# Altium schematic sheet Sheet_clock_circuite.SchDoc
size A3
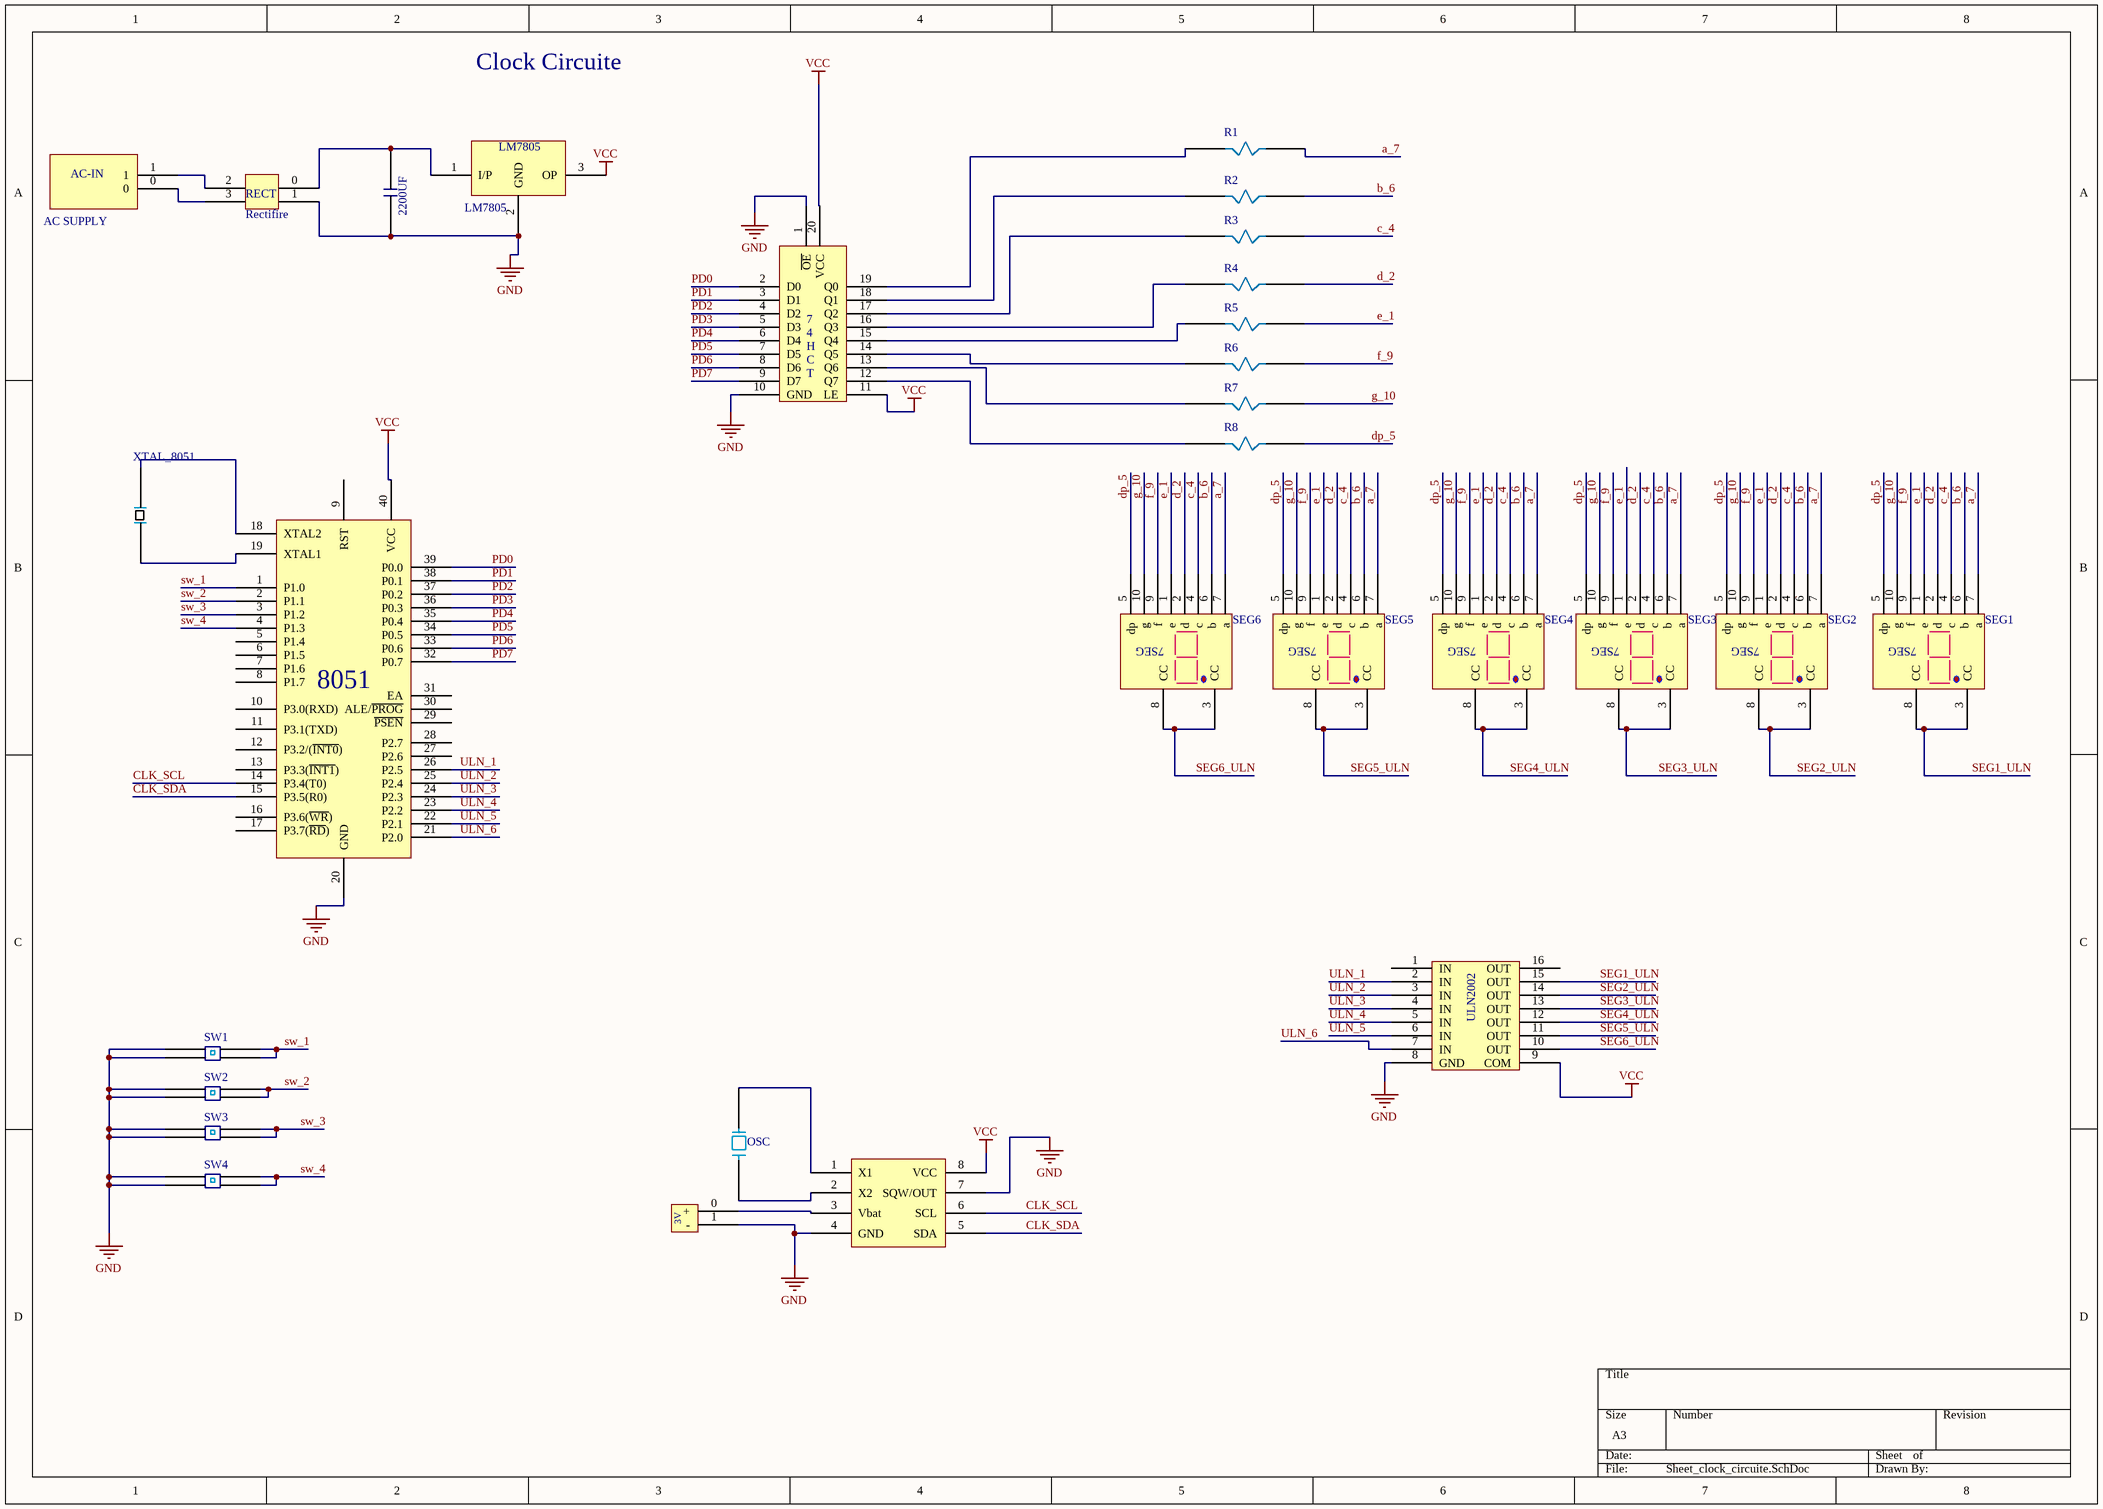
[diagram p0: Sheet_clock_circuite.SchDoc]

## Parts
3V  Battery_3V  [3V BAT]  (value not drawn)
74HCT  74_HCT  [74HCT]  (value not drawn)
7805  LM7805  [L7805]
8051  Microcontroller  [NUV_8051]  (value not drawn)
110592MHZ  XTAL_8051  [osc_12]
AC  AC SUPPLY  [CONNECTOR]
CAP  CF2200UF  [CAP2200UF]  (value not drawn)
CLK  DS1307_RTC  [DS1307]  (value not drawn)
OSC  OSCILLATOR  [OSC_32K]  (value not drawn)
R1  RES330  [RES]  (value not drawn)
R2  RES330  [RES]  (value not drawn)
R3  RES330  [RES]  (value not drawn)
R4  RES330  [RES]  (value not drawn)
R5  RES330  [RES]  (value not drawn)
R6  RES330  [RES]  (value not drawn)
R7  RES330  [RES]  (value not drawn)
R8  RES330  [RES]  (value not drawn)
REC  Rectifire  [RECT]
SEG1  7SEGMENT  [LED_Display]  (value not drawn)
SEG2  7SEGMENT  [LED_Display]  (value not drawn)
SEG3  7SEGMENT  [LED_Display]  (value not drawn)
SEG4  7SEGMENT  [LED_Display]  (value not drawn)
SEG5  7SEGMENT  [LED_Display]  (value not drawn)
SEG6  7SEGMENT  [LED_Display]  (value not drawn)
SW1  SWITCH  [SWITCH]  (value not drawn)
SW2  SWITCH  [SWITCH]  (value not drawn)
SW3  SWITCH  [SWITCH]  (value not drawn)
SW4  SWITCH  [SWITCH]  (value not drawn)
uln  ULN2002  [ULN2002]  (value not drawn)

## Nets
GND: 3V.1(-) 74HCT.1(~{OE}) 74HCT.10(GND) 7805.2(GND) 8051.20(GND) CAP.1 CLK.4(GND) CLK.7(SQW/OUT) REC.1 SW1.0 SW1.1 SW2.0 SW2.1 SW3.0 SW3.1 SW4.0 SW4.1 uln.8(GND)
VCC: 74HCT.11(LE) 74HCT.20(VCC) 7805.3(OP) 8051.40(VCC) CLK.8(VCC) uln.9(COM)
a_7: R1.1 SEG1.7(a) SEG2.7(a) SEG3.7(a) SEG4.7(a) SEG5.7(a) SEG6.7(a)
b_6: R2.1 SEG1.6(b) SEG2.6(b) SEG3.6(b) SEG4.6(b) SEG5.6(b) SEG6.6(b)
c_4: R3.1 SEG1.4(c) SEG2.4(c) SEG3.4(c) SEG4.4(c) SEG5.4(c) SEG6.4(c)
CLK_SCL: 8051.14(P3.4(T0)) CLK.6(SCL)
CLK_SDA: 8051.15(P3.5(R0)) CLK.5(SDA)
d_2: R4.1 SEG1.2(d) SEG2.2(d) SEG3.2(d) SEG4.2(d) SEG5.2(d) SEG6.2(d)
dp_5: R8.1 SEG1.5(dp) SEG2.5(dp) SEG3.5(dp) SEG4.5(dp) SEG5.5(dp) SEG6.5(dp)
e_1: R5.1 SEG1.1(e) SEG2.1(e) SEG3.1(e) SEG4.1(e) SEG5.1(e) SEG6.1(e)
f_9: R6.1 SEG1.9(f) SEG2.9(f) SEG3.9(f) SEG4.9(f) SEG5.9(f) SEG6.9(f)
g_10: R7.1 SEG1.10(g) SEG2.10(g) SEG3.10(g) SEG4.10(g) SEG5.10(g) SEG6.10(g)
PD0: 74HCT.2(D0) 8051.39(P0.0)
PD1: 74HCT.3(D1) 8051.38(P0.1)
PD2: 74HCT.4(D2) 8051.37(P0.2)
PD3: 74HCT.5(D3) 8051.36(P0.3)
PD4: 74HCT.6(D4) 8051.35(P0.4)
PD5: 74HCT.7(D5) 8051.34(P0.5)
PD6: 74HCT.8(D6) 8051.33(P0.6)
PD7: 74HCT.9(D7) 8051.32(P0.7)
SEG1_ULN: SEG1.3(CC) SEG1.8(CC) uln.15(OUT)
SEG2_ULN: SEG2.3(CC) SEG2.8(CC) uln.14(OUT)
SEG3_ULN: SEG3.3(CC) SEG3.8(CC) uln.13(OUT)
SEG4_ULN: SEG4.3(CC) SEG4.8(CC) uln.12(OUT)
SEG5_ULN: SEG5.3(CC) SEG5.8(CC) uln.11(OUT)
SEG6_ULN: SEG6.3(CC) SEG6.8(CC) uln.10(OUT)
sw_1: 8051.1(P1.0) SW1.2 SW1.3
sw_2: 8051.2(P1.1) SW2.2 SW2.3
sw_3: 8051.3(P1.2) SW3.2 SW3.3
sw_4: 8051.4(P1.3) SW4.2 SW4.3
ULN_1: 8051.26(P2.5) uln.2(IN)
ULN_2: 8051.25(P2.4) uln.3(IN)
ULN_3: 8051.24(P2.3) uln.4(IN)
ULN_4: 8051.23(P2.2) uln.5(IN)
ULN_5: 8051.22(P2.1) uln.6(IN)
ULN_6: 8051.21(P2.0) uln.7(IN)
Net3V_0: 3V.0(+) CLK.3(Vbat)
Net74HCT_12: 74HCT.12(Q7) R8.0
Net74HCT_13: 74HCT.13(Q6) R7.0
Net74HCT_14: 74HCT.14(Q5) R6.0
Net74HCT_15: 74HCT.15(Q4) R5.0
Net74HCT_16: 74HCT.16(Q3) R4.0
Net74HCT_17: 74HCT.17(Q2) R3.0
Net74HCT_18: 74HCT.18(Q1) R2.0
Net74HCT_19: 74HCT.19(Q0) R1.0
Net7805_1: 7805.1(I/P) CAP.0 REC.0
Net8051_18: 8051.18(XTAL2) 110592MHZ.1
Net8051_19: 8051.19(XTAL1) 110592MHZ.0
NetAC_0: AC.0 REC.3
NetAC_1: AC.1 REC.2
NetCLK_1: CLK.1(X1) OSC.1
NetCLK_2: CLK.2(X2) OSC.0

Not connected (* = marked no-connect by the designer): 8051 5(P1.4) 6(P1.5) 7(P1.6) 8(P1.7) 9(RST) 10(P3.0(RXD)) 11(P3.1(TXD)) 12(P3.2/(~{INT0})) 13(P3.3(~{INT1})) 16(P3.6(~{WR})) 17(P3.7(~{RD})) 27(P2.6) 28(P2.7) 29(~{PSEN}) 30(ALE/~{PROG}) 31(EA); uln 1(IN) 16(OUT)

## Notes on the sheet
- Clock Circuite
- (in symbol 7-SEGMENTS) 7SEG
- (in symbol 74_HCT) H; C; T
- (in symbol AC SUPPLY) AC-IN
- (in symbol CF2200UF) 2200UF
- (in symbol Rectifire) RECT

## Library data of the parts
8051 = 8051
SEG1-SEG6 = 7-SEGMENTS